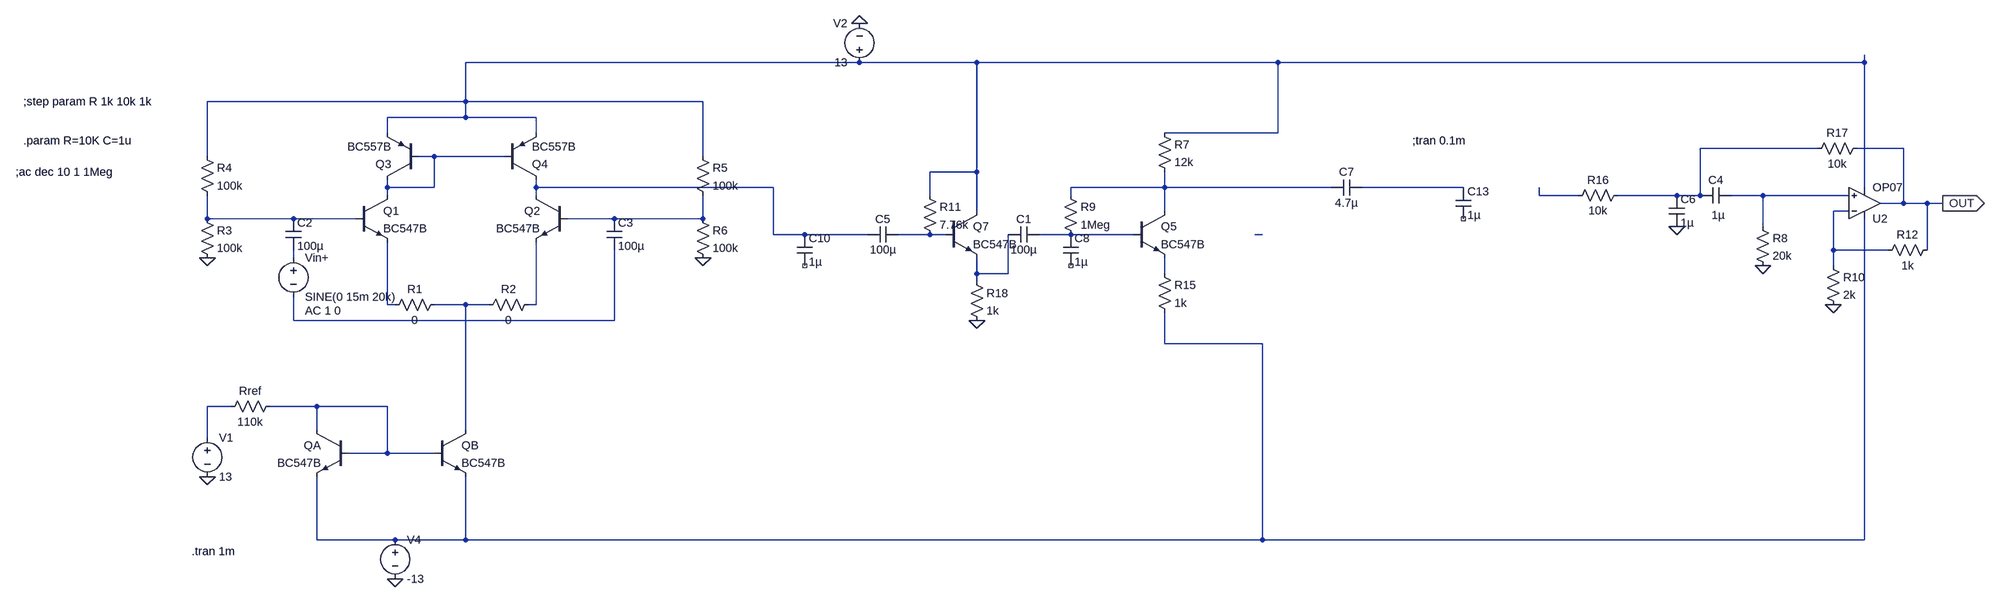
[diagram p0: schematic BJT_Diff_amp_Gain_DE_4_diff_in_negIn_Buffer_3.asc]
BJT_Diff_amp_Gain_DE_4_diff_in_negIn_Buffer_3.asc, the LTspice schematic file:
Version 4
SHEET 1 4060 1044
WIRE 1072 -192 160 -192
WIRE 1312 -192 1072 -192
WIRE 1936 -192 1312 -192
WIRE 3792 -192 3792 -208
WIRE 3792 -192 1936 -192
WIRE 160 -112 160 -192
WIRE 160 -112 -368 -112
WIRE 752 -112 160 -112
WIRE 160 -80 160 -112
WIRE 160 -80 0 -80
WIRE 304 -80 160 -80
WIRE 0 -48 0 -80
WIRE 304 -48 304 -80
WIRE 1936 -48 1936 -192
WIRE 1936 -48 1696 -48
WIRE 3696 -16 3456 -16
WIRE 3872 -16 3776 -16
WIRE -368 0 -368 -112
WIRE 96 0 64 0
WIRE 240 0 96 0
WIRE 752 0 752 -112
WIRE 1312 32 1312 -192
WIRE 1312 32 1216 32
WIRE 0 64 0 48
WIRE 96 64 96 0
WIRE 96 64 0 64
WIRE 304 64 304 48
WIRE 896 64 304 64
WIRE 1696 64 1696 32
WIRE 1696 64 1504 64
WIRE 2336 64 1696 64
WIRE 2720 64 2400 64
WIRE 3792 64 3792 -192
WIRE 0 80 0 64
WIRE 304 80 304 64
WIRE 1216 80 1216 32
WIRE 1504 80 1504 64
WIRE 3072 80 3072 64
WIRE 3152 80 3072 80
WIRE 3408 80 3232 80
WIRE 3456 80 3456 -16
WIRE 3456 80 3408 80
WIRE 3584 80 3520 80
WIRE 3760 80 3584 80
WIRE 3872 96 3872 -16
WIRE 3872 96 3824 96
WIRE 3920 96 3872 96
WIRE 3952 96 3920 96
WIRE 1312 112 1312 32
WIRE 1696 112 1696 64
WIRE 3760 112 3728 112
WIRE -368 128 -368 80
WIRE -192 128 -368 128
WIRE -64 128 -192 128
WIRE 464 128 368 128
WIRE 752 128 752 80
WIRE 752 128 464 128
WIRE 3584 144 3584 80
WIRE 896 160 896 64
WIRE 960 160 896 160
WIRE 1088 160 960 160
WIRE 1216 160 1152 160
WIRE 1248 160 1216 160
WIRE 1504 160 1440 160
WIRE 1632 160 1504 160
WIRE 1904 160 1888 160
WIRE 3728 192 3728 112
WIRE 3840 192 3728 192
WIRE 3920 192 3920 96
WIRE -192 208 -192 192
WIRE 3728 224 3728 192
WIRE 1312 240 1312 208
WIRE 1376 240 1376 160
WIRE 1376 240 1312 240
WIRE 1696 240 1696 208
WIRE 1312 256 1312 240
WIRE 0 304 0 176
WIRE 16 304 0 304
WIRE 160 304 96 304
WIRE 208 304 160 304
WIRE 304 304 304 176
WIRE 304 304 288 304
WIRE -192 336 -192 288
WIRE 464 336 464 192
WIRE 464 336 -192 336
WIRE 1696 384 1696 320
WIRE 1904 384 1696 384
WIRE -320 512 -368 512
WIRE -144 512 -240 512
WIRE 0 512 -144 512
WIRE -144 560 -144 512
WIRE 160 560 160 304
WIRE -368 576 -368 512
WIRE 0 608 0 512
WIRE 0 608 -80 608
WIRE 96 608 0 608
WIRE -144 880 -144 656
WIRE 16 880 -144 880
WIRE 160 880 160 656
WIRE 160 880 16 880
WIRE 1904 880 1904 384
WIRE 1904 880 160 880
WIRE 3792 880 3792 128
WIRE 3792 880 1904 880
FLAG -368 656 0
FLAG -368 208 0
FLAG 752 208 0
FLAG 3952 96 OUT
IOPIN 3952 96 Out
FLAG 16 960 0
FLAG 1072 -272 0
FLAG 1312 336 0
FLAG 3408 144 0
FLAG 3584 224 0
FLAG 3728 304 0
SYMBOL npn 368 80 M0
SYMATTR InstName Q2
SYMATTR Value BC547B
SYMBOL npn -64 80 R0
SYMATTR InstName Q1
SYMATTR Value BC547B
SYMBOL res 112 288 R90
WINDOW 0 0 56 VBottom 2
WINDOW 3 32 56 VTop 2
SYMATTR InstName R1
SYMATTR Value 0
SYMBOL res 304 288 R90
WINDOW 0 0 56 VBottom 2
WINDOW 3 32 56 VTop 2
SYMATTR InstName R2
SYMATTR Value 0
SYMBOL npn 96 560 R0
SYMATTR InstName QB
SYMATTR Value BC547B
SYMBOL npn -80 560 M0
SYMATTR InstName QA
SYMATTR Value BC547B
SYMBOL res -224 496 R90
WINDOW 0 0 56 VBottom 2
WINDOW 3 32 56 VTop 2
SYMATTR InstName Rref
SYMATTR Value 110k
SYMBOL voltage -192 192 R0
WINDOW 123 24 124 Left 2
WINDOW 39 0 0 Left 0
SYMATTR Value2 AC 1 0
SYMATTR InstName Vin+
SYMATTR Value SINE(0 15m 20k)
SYMBOL voltage -368 560 R0
WINDOW 123 0 0 Left 0
WINDOW 39 0 0 Left 0
SYMATTR InstName V1
SYMATTR Value 13
SYMBOL cap -208 128 R0
SYMATTR InstName C2
SYMATTR Value 100µ
SYMBOL res -384 112 R0
SYMATTR InstName R3
SYMATTR Value 100k
SYMBOL res -384 -16 R0
SYMATTR InstName R4
SYMATTR Value 100k
SYMBOL res 736 -16 R0
SYMATTR InstName R5
SYMATTR Value 100k
SYMBOL res 736 112 R0
SYMATTR InstName R6
SYMATTR Value 100k
SYMBOL npn 1632 112 R0
SYMATTR InstName Q5
SYMATTR Value BC547B
SYMBOL res 1680 -64 R0
SYMATTR InstName R7
SYMATTR Value 12k
SYMBOL cap 1440 144 R90
WINDOW 0 0 32 VBottom 2
WINDOW 3 32 32 VTop 2
SYMATTR InstName C1
SYMATTR Value 100µ
SYMBOL cap 1152 144 R90
WINDOW 0 0 32 VBottom 2
WINDOW 3 32 32 VTop 2
SYMATTR InstName C5
SYMATTR Value 100µ
SYMBOL res 1680 224 R0
SYMATTR InstName R15
SYMATTR Value 1k
SYMBOL res 1488 64 R0
SYMATTR InstName R9
SYMATTR Value 1Meg
SYMBOL cap 448 128 R0
SYMATTR InstName C3
SYMATTR Value 100µ
SYMBOL cap 3520 64 R90
WINDOW 0 0 32 VBottom 2
WINDOW 3 41 27 VTop 2
SYMATTR InstName C4
SYMATTR Value 1µ
SYMBOL res 3248 64 R90
WINDOW 0 0 56 VBottom 2
WINDOW 3 32 56 VTop 2
SYMATTR InstName R16
SYMATTR Value 10k
SYMBOL res 3792 -32 R90
WINDOW 0 0 56 VBottom 2
WINDOW 3 32 56 VTop 2
SYMATTR InstName R17
SYMATTR Value 10k
SYMBOL voltage 16 864 R0
WINDOW 123 0 0 Left 0
WINDOW 39 0 0 Left 0
SYMATTR InstName V4
SYMATTR Value -13
SYMBOL voltage 1072 -176 R180
WINDOW 0 24 96 Left 2
WINDOW 3 24 16 Left 2
WINDOW 123 0 0 Left 0
WINDOW 39 0 0 Left 0
SYMATTR InstName V2
SYMATTR Value 13
SYMBOL pnp 64 48 R180
SYMATTR InstName Q3
SYMATTR Value BC557B
SYMBOL pnp 240 48 M180
SYMATTR InstName Q4
SYMATTR Value BC557B
SYMBOL cap 2400 48 R90
WINDOW 0 0 32 VBottom 2
WINDOW 3 32 32 VTop 2
SYMATTR InstName C7
SYMATTR Value 4.7µ
SYMBOL npn 1248 112 R0
SYMATTR InstName Q7
SYMATTR Value BC547B
SYMBOL res 1200 64 R0
SYMATTR InstName R11
SYMATTR Value 7.76k
SYMBOL res 1296 240 R0
SYMATTR InstName R18
SYMATTR Value 1k
SYMBOL cap 1488 160 R0
SYMATTR InstName C8
SYMATTR Value 1µ
SYMBOL cap 944 160 R0
SYMATTR InstName C10
SYMATTR Value 1µ
SYMBOL cap 2704 64 R0
SYMATTR InstName C13
SYMATTR Value 1µ
SYMBOL cap 3392 80 R0
SYMATTR InstName C6
SYMATTR Value 1µ
SYMBOL OpAmps\\OP07 3792 160 M180
SYMATTR InstName U2
SYMBOL res 3568 128 R0
SYMATTR InstName R8
SYMATTR Value 20k
SYMBOL res 3712 208 R0
SYMATTR InstName R10
SYMATTR Value 2k
SYMBOL res 3936 176 R90
WINDOW 0 0 56 VBottom 2
WINDOW 3 32 56 VTop 2
SYMATTR InstName R12
SYMATTR Value 1k
TEXT -400 904 Left 2 !.tran 1m
TEXT -760 32 Left 2 !;ac dec 10 1 1Meg
TEXT 2616 -32 Left 2 !;tran 0.1m
TEXT -744 -32 Left 2 !.param R=10K C=1u
TEXT -744 -112 Left 2 !;step param R 1k 10k 1k

The netlist it stands for:
* BJT_Diff_amp_Gain_DE_4_diff_in_negIn_Buffer_3.asc
Q2 N004 N011 N020 0 BC547B
Q1 N003 N010 N018 0 BC547B
R1 N019 N018 0
R2 N020 N019 0
QB N019 N024 N022 0 BC547B
QA N024 N024 N022 0 BC547B
Rref N024 N023 110k
Vin+ N015 N021 SINE(0 15m 20k) AC 1 0
V1 N023 0 13
C2 N010 N015 100µ
R3 N010 0 100k
R4 N001 N010 100k
R5 N001 N011 100k
R6 N011 0 100k
Q5 N005 N013 N017 0 BC547B
R7 N001 N005 12k
C1 N013 N016 100µ
C5 N012 N004 100µ
R15 N017 N022 1k
R9 N005 N013 1Meg
C3 N011 N021 100µ
C4 N008 N002 1µ
R16 N002 N007 10k
R17 OUT N002 10k
V4 N022 0 -13
V2 N001 0 13
Q3 N003 N003 N001 0 BC557B
Q4 N004 N003 N001 0 BC557B
C7 N006 N005 4.7µ
Q7 N001 N012 N016 0 BC547B
R11 N001 N012 7.76k
R18 N016 0 1k
C8 N013 NC_01 1µ
C10 N004 NC_02 1µ
C13 N006 NC_03 1µ
C6 N002 0 1µ
XU2 N008 N009 N022 N001 OUT LT1001  ; OP07, pins In+ In- V+ V- OUT
R8 N008 0 20k
R10 N009 0 2k
R12 OUT N009 1k
.model NPN NPN
.model PNP PNP
.lib standard.bjt
.tran 1m
;ac dec 10 1 1Meg
;tran 0.1m
.param R=10K C=1u
;step param R 1k 10k 1k
.lib LTC.lib
.backanno
.end